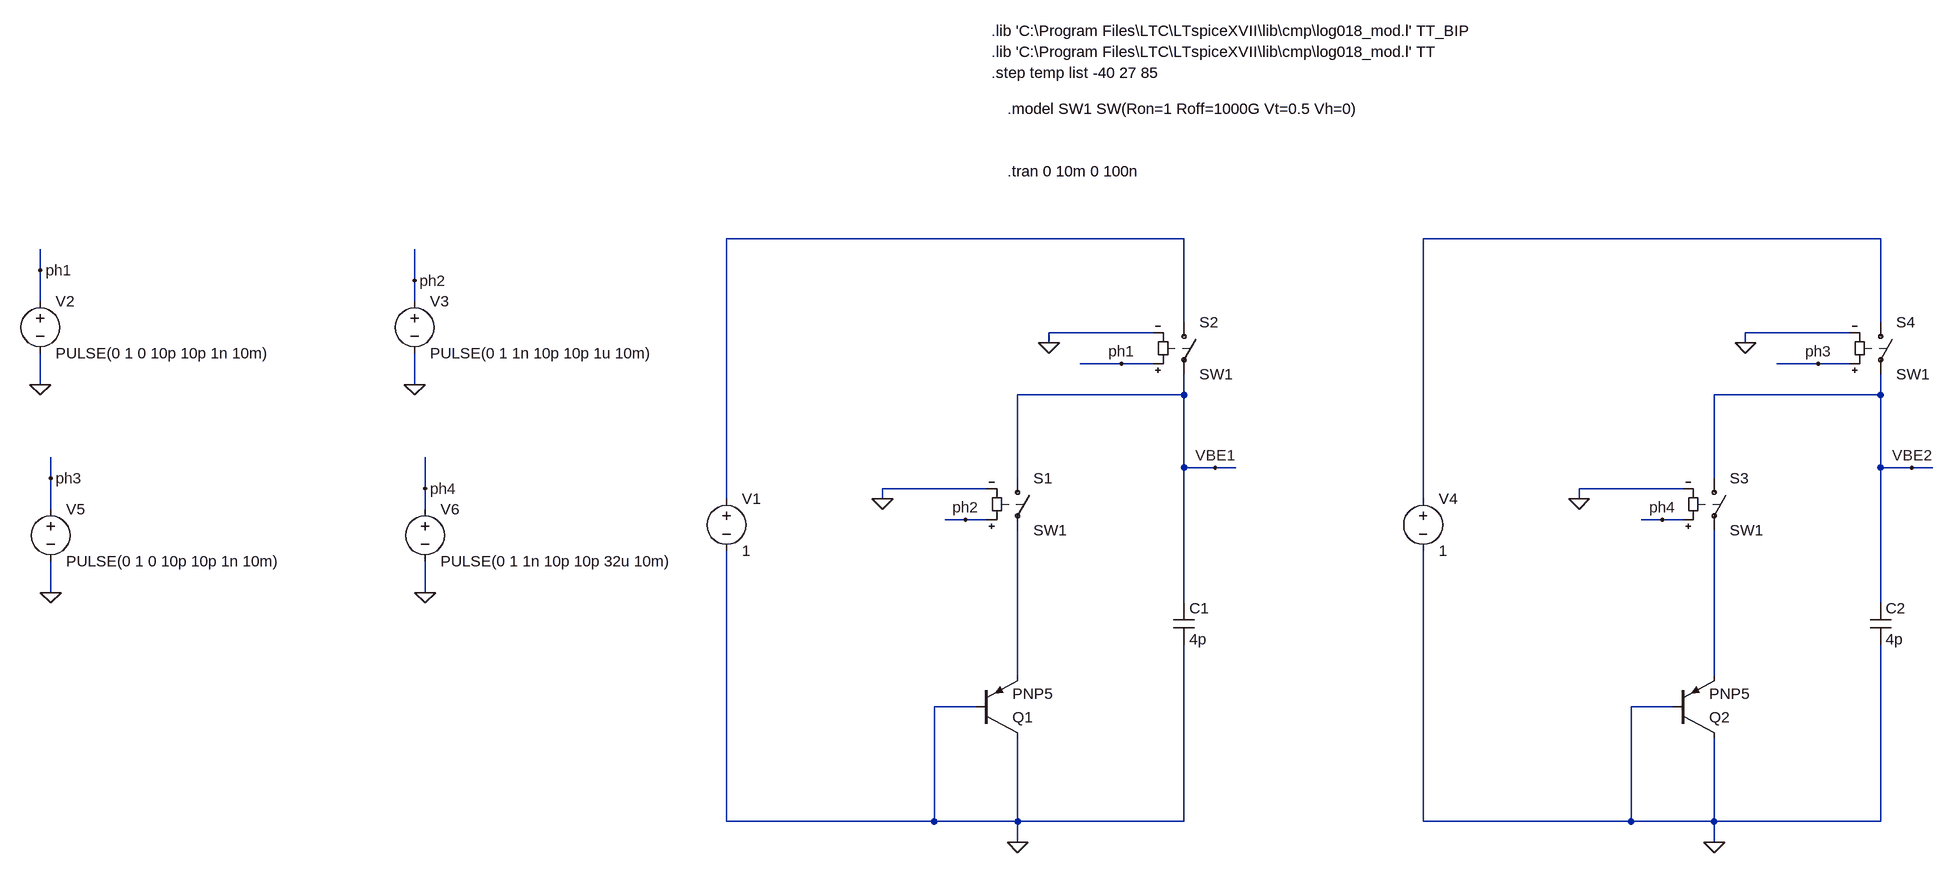
[diagram p0: schematic CB_BJT_PTAT.asc]
CB_BJT_PTAT.asc, the LTspice schematic file:
Version 4
SHEET 1 2248 788
WIRE 512 -224 -192 -224
WIRE 1584 -224 880 -224
WIRE -1248 -176 -1248 -208
WIRE -672 -160 -672 -208
WIRE -1248 -128 -1248 -176
WIRE -672 -128 -672 -160
WIRE 512 -96 512 -224
WIRE 1584 -96 1584 -224
WIRE 464 -80 304 -80
WIRE 1536 -80 1376 -80
WIRE 304 -64 304 -80
WIRE 1376 -64 1376 -80
WIRE 416 -32 352 -32
WIRE 464 -32 416 -32
WIRE 1488 -32 1424 -32
WIRE 1536 -32 1488 -32
WIRE -1248 0 -1248 -48
WIRE -672 0 -672 -48
WIRE 512 16 512 -16
WIRE 512 16 256 16
WIRE 1584 16 1584 -16
WIRE 1584 16 1328 16
WIRE 512 128 512 16
WIRE 560 128 512 128
WIRE 592 128 560 128
WIRE 1584 128 1584 16
WIRE 1632 128 1584 128
WIRE 1664 128 1632 128
WIRE -1232 144 -1232 112
WIRE 256 144 256 16
WIRE 1328 144 1328 16
WIRE -656 160 -656 112
WIRE 208 160 48 160
WIRE 1280 160 1120 160
WIRE -192 176 -192 -224
WIRE 48 176 48 160
WIRE 880 176 880 -224
WIRE 1120 176 1120 160
WIRE -1232 192 -1232 144
WIRE -656 192 -656 160
WIRE 176 208 144 208
WIRE 208 208 176 208
WIRE 1248 208 1216 208
WIRE 1280 208 1248 208
WIRE -1232 320 -1232 272
WIRE -656 320 -656 272
WIRE 512 336 512 128
WIRE 1584 336 1584 128
WIRE 256 448 256 224
WIRE 1328 448 1328 224
WIRE 192 496 128 496
WIRE 1264 496 1200 496
WIRE -192 672 -192 256
WIRE 128 672 128 496
WIRE 128 672 -192 672
WIRE 256 672 256 544
WIRE 256 672 128 672
WIRE 512 672 512 400
WIRE 512 672 256 672
WIRE 880 672 880 256
WIRE 1200 672 1200 496
WIRE 1200 672 880 672
WIRE 1328 672 1328 544
WIRE 1328 672 1200 672
WIRE 1584 672 1584 400
WIRE 1584 672 1328 672
WIRE 256 704 256 672
WIRE 1328 704 1328 672
FLAG 256 704 0
FLAG 48 176 0
FLAG 304 -64 0
FLAG -1248 0 0
FLAG -1248 -176 ph1
FLAG 416 -32 ph1
FLAG 176 208 ph2
FLAG -672 0 0
FLAG -672 -160 ph2
FLAG 560 128 VBE1
FLAG 1328 704 0
FLAG 1120 176 0
FLAG 1376 -64 0
FLAG 1488 -32 ph3
FLAG 1248 208 ph4
FLAG 1632 128 VBE2
FLAG -1232 320 0
FLAG -1232 144 ph3
FLAG -656 320 0
FLAG -656 160 ph4
SYMBOL pnp2 192 544 M180
SYMATTR InstName Q1
SYMATTR Value PNP5
SYMBOL voltage -192 160 R0
WINDOW 123 0 0 Left 0
WINDOW 39 0 0 Left 0
SYMATTR InstName V1
SYMATTR Value 1
SYMBOL cap 496 336 R0
SYMATTR InstName C1
SYMATTR Value 4p
SYMBOL sw 256 128 R0
SYMATTR InstName S1
SYMATTR Value SW1
SYMBOL sw 512 -112 R0
SYMATTR InstName S2
SYMATTR Value SW1
SYMBOL voltage -1248 -144 R0
WINDOW 123 0 0 Left 0
WINDOW 39 0 0 Left 0
SYMATTR InstName V2
SYMATTR Value PULSE(0 1 0 10p 10p 1n 10m)
SYMBOL voltage -672 -144 R0
WINDOW 123 0 0 Left 0
WINDOW 39 0 0 Left 0
SYMATTR InstName V3
SYMATTR Value PULSE(0 1 1n 10p 10p 1u 10m)
SYMBOL pnp2 1264 544 M180
SYMATTR InstName Q2
SYMATTR Value PNP5
SYMBOL voltage 880 160 R0
WINDOW 123 0 0 Left 0
WINDOW 39 0 0 Left 0
SYMATTR InstName V4
SYMATTR Value 1
SYMBOL cap 1568 336 R0
SYMATTR InstName C2
SYMATTR Value 4p
SYMBOL sw 1328 128 R0
SYMATTR InstName S3
SYMATTR Value SW1
SYMBOL sw 1584 -112 R0
SYMATTR InstName S4
SYMATTR Value SW1
SYMBOL voltage -1232 176 R0
WINDOW 123 0 0 Left 0
WINDOW 39 0 0 Left 0
SYMATTR InstName V5
SYMATTR Value PULSE(0 1 0 10p 10p 1n 10m)
SYMBOL voltage -656 176 R0
WINDOW 123 0 0 Left 0
WINDOW 39 0 0 Left 0
SYMATTR InstName V6
SYMATTR Value PULSE(0 1 1n 10p 10p 32u 10m)
TEXT 216 -480 Left 2 !.step temp list -40 27 85
TEXT 216 -512 Left 2 !.lib 'C:\\Program Files\\LTC\\LTspiceXVII\\lib\\cmp\\log018_mod.l' TT
TEXT 216 -544 Left 2 !.lib 'C:\\Program Files\\LTC\\LTspiceXVII\\lib\\cmp\\log018_mod.l' TT_BIP
TEXT 240 -424 Left 2 !.model SW1 SW(Ron=1 Roff=1000G Vt=0.5 Vh=0)
TEXT 240 -328 Left 2 !.tran 0 10m 0 100n

The netlist it stands for:
* CB_BJT_PTAT.asc
Q1 0 0 N003 0 PNP5
V1 N001 0 1
C1 VBE1 0 4p
S1 VBE1 N003 ph2 0 SW1
S2 N001 VBE1 ph1 0 SW1
V2 ph1 0 PULSE(0 1 0 10p 10p 1n 10m)
V3 ph2 0 PULSE(0 1 1n 10p 10p 1u 10m)
Q2 0 0 N004 0 PNP5
V4 N002 0 1
C2 VBE2 0 4p
S3 VBE2 N004 ph4 0 SW1
S4 N002 VBE2 ph3 0 SW1
V5 ph3 0 PULSE(0 1 0 10p 10p 1n 10m)
V6 ph4 0 PULSE(0 1 1n 10p 10p 32u 10m)
.model NPN NPN
.model PNP PNP
.lib standard.bjt
.step temp list -40 27 85
.lib 'C:\Program Files\LTC\LTspiceXVII\lib\cmp\log018_mod.l' TT
.lib 'C:\Program Files\LTC\LTspiceXVII\lib\cmp\log018_mod.l' TT_BIP
.model SW1 SW(Ron=1 Roff=1000G Vt=0.5 Vh=0)
.tran 0 10m 0 100n
.backanno
.end